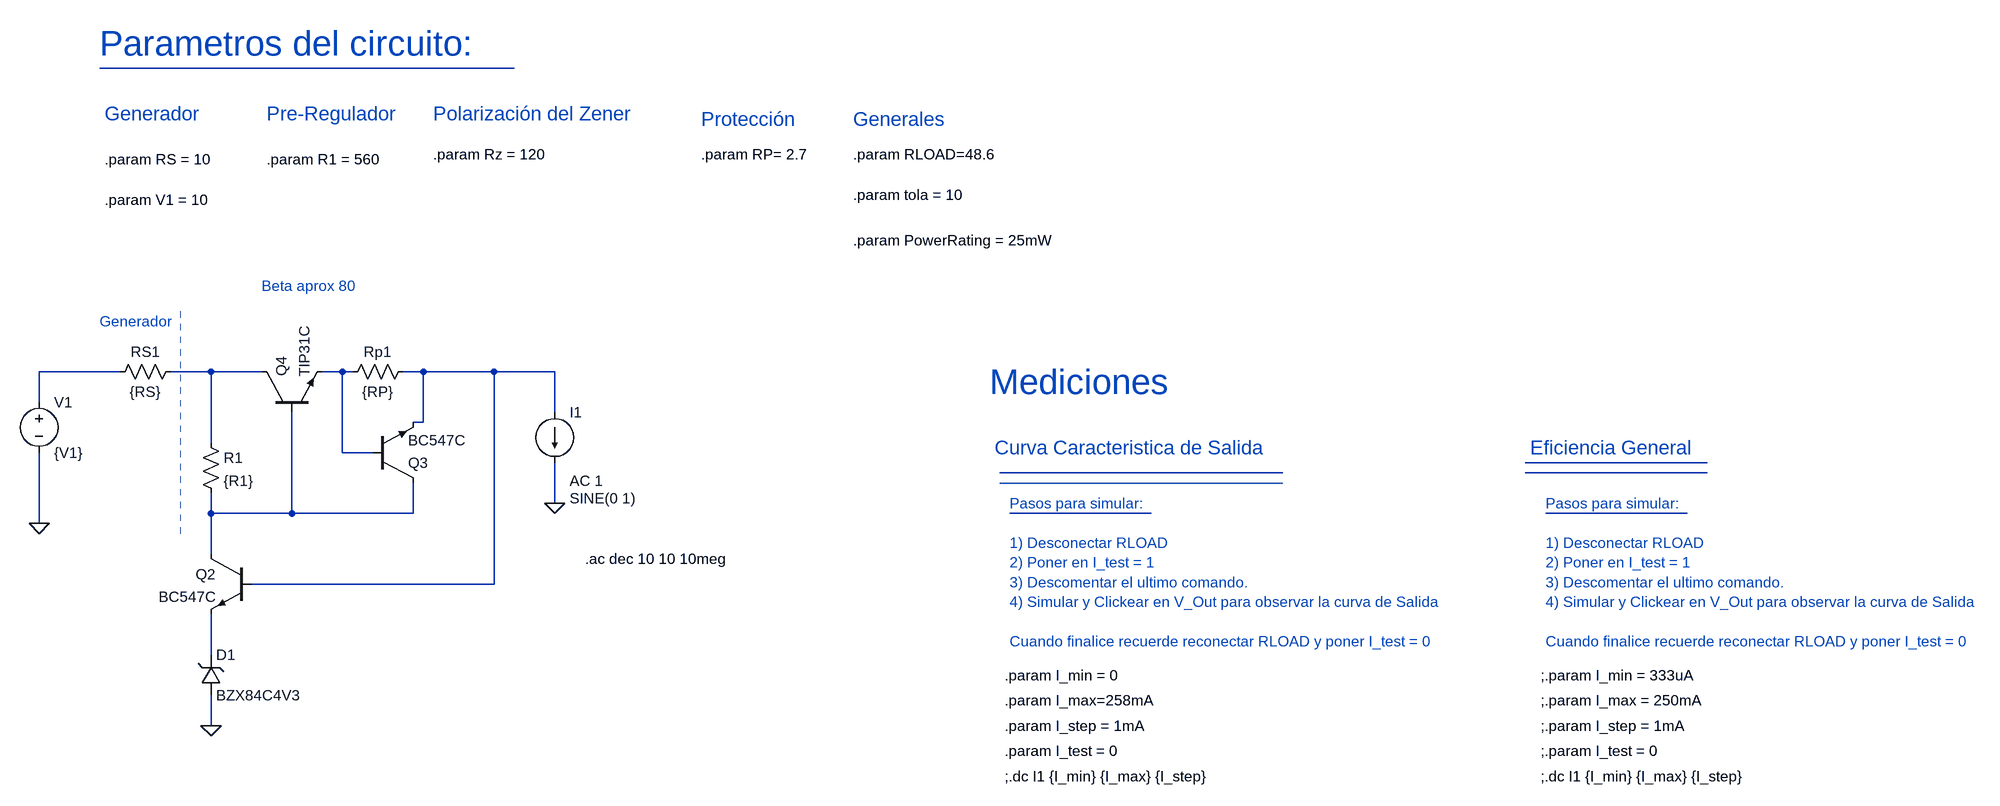
[diagram p0: schematic Draft1.asc]
Draft1.asc, the LTspice schematic file:
Version 4
SHEET 1 1764 680
WIRE -608 -480 -1264 -480
WIRE -1232 0 -1360 0
WIRE -1088 0 -1152 0
WIRE -1008 0 -1088 0
WIRE -880 0 -912 0
WIRE -864 0 -880 0
WIRE -752 0 -784 0
WIRE -640 0 -752 0
WIRE -544 0 -640 0
WIRE -1360 48 -1360 0
WIRE -544 64 -544 0
WIRE -752 80 -752 0
WIRE -752 80 -768 80
WIRE -1088 112 -1088 0
WIRE -880 128 -880 0
WIRE -832 128 -880 128
WIRE 1280 144 992 144
WIRE 608 160 160 160
WIRE 1280 160 992 160
WIRE -544 208 -544 144
WIRE -1088 224 -1088 192
WIRE -960 224 -960 64
WIRE -960 224 -1088 224
WIRE -768 224 -768 176
WIRE -768 224 -960 224
WIRE 400 224 176 224
WIRE 1248 224 1024 224
WIRE -1360 240 -1360 128
WIRE -1088 288 -1088 224
WIRE -640 336 -640 0
WIRE -640 336 -1024 336
WIRE -1088 448 -1088 384
WIRE -1088 560 -1088 512
FLAG -1360 240 0
FLAG -1088 560 0
FLAG -544 208 0
DATAFLAG -656 0 ""
DATAFLAG -1088 0 ""
DATAFLAG -1088 224 ""
SYMBOL res -1136 -16 R90
WINDOW 0 0 56 VBottom 2
WINDOW 3 32 56 VTop 2
SYMATTR InstName RS1
SYMATTR Value {RS}
SYMATTR SpiceLine tol={tola} pwr={PowerRating }
SYMBOL npn -1024 288 M0
SYMATTR InstName Q2
SYMATTR Value BC547C
SYMBOL zener -1104 512 M180
WINDOW 0 24 64 Left 2
WINDOW 3 24 0 Left 2
SYMATTR InstName D1
SYMATTR Value BZX84C4V3
SYMBOL res -768 -16 R90
WINDOW 0 0 56 VBottom 2
WINDOW 3 32 56 VTop 2
SYMATTR InstName Rp1
SYMATTR Value {RP}
SYMATTR SpiceLine tol={tola} pwr={PowerRating}
SYMBOL res -1104 96 R0
SYMATTR InstName R1
SYMATTR Value {R1}
SYMATTR SpiceLine tol={tola} pwr={PowerRating}
SYMBOL npn -832 176 M180
SYMATTR InstName Q3
SYMATTR Value BC547C
SYMBOL current -544 64 R0
WINDOW 3 24 136 Left 2
WINDOW 123 24 108 Left 2
WINDOW 39 0 0 Left 0
SYMATTR InstName I1
SYMATTR Value SINE(0 1)
SYMATTR Value2 AC 1
SYMBOL voltage -1360 32 R0
WINDOW 123 0 0 Left 0
WINDOW 39 0 0 Left 0
SYMATTR InstName V1
SYMATTR Value {V1}
SYMBOL npn -1008 64 R270
SYMATTR InstName Q4
SYMATTR Value TIP31C
TEXT -1264 -80 Left 2 ;Generador
TEXT -1008 -136 Left 2 ;Beta aprox 80
TEXT 144 16 Left 5 ;Mediciones
TEXT 152 120 Left 3 ;Curva Caracteristica de Salida
TEXT 168 480 Left 2 !.param I_min = 0
TEXT 168 520 Left 2 !.param I_max=258mA
TEXT 168 560 Left 2 !.param I_step = 1mA
TEXT 168 600 Left 2 !.param I_test = 0
TEXT 176 208 Left 2 ;Pasos para simular:\n \n1) Desconectar RLOAD\n2) Poner en I_test = 1\n3) Descomentar el ultimo comando.\n4) Simular y Clickear en V_Out para observar la curva de Salida\n \nCuando finalice recuerde reconectar RLOAD y poner I_test = 0
TEXT -1264 -520 Left 5 ;Parametros del circuito:
TEXT -1256 -336 Left 2 !.param RS = 10
TEXT -1256 -272 Left 2 !.param V1 = 10
TEXT -1000 -336 Left 2 !.param R1 = 560
TEXT -1256 -408 Left 3 ;Generador
TEXT -1000 -408 Left 3 ;Pre-Regulador
TEXT -736 -408 Left 3 ;Polarización del Zener
TEXT -736 -344 Left 2 !.param Rz = 120
TEXT -312 -344 Left 2 !.param RP= 2.7
TEXT -312 -400 Left 3 ;Protección
TEXT 1016 640 Left 2 !;.dc I1 {I_min} {I_max} {I_step}
TEXT 1000 120 Left 3 ;Eficiencia General
TEXT 1016 480 Left 2 !;.param I_min = 333uA
TEXT 1016 520 Left 2 !;.param I_max = 250mA
TEXT 1016 560 Left 2 !;.param I_step = 1mA
TEXT 1016 600 Left 2 !;.param I_test = 0
TEXT 1024 208 Left 2 ;Pasos para simular:\n \n1) Desconectar RLOAD\n2) Poner en I_test = 1\n3) Descomentar el ultimo comando.\n4) Simular y Clickear en V_Out para observar la curva de Salida\n \nCuando finalice recuerde reconectar RLOAD y poner I_test = 0
TEXT -72 -280 Left 2 !.param tola = 10
TEXT -72 -344 Left 2 !.param RLOAD=48.6
TEXT -72 -400 Left 3 ;Generales
TEXT -72 -208 Left 2 !.param PowerRating = 25mW
TEXT 168 640 Left 2 !;.dc I1 {I_min} {I_max} {I_step}
TEXT -496 296 Left 2 !.ac dec 10 10 10meg
LINE Normal -1136 256 -1136 -96 2
LINE Normal 608 176 160 176

The netlist it stands for:
* Draft1.asc
RS1 N003 N002 {RS} tol={tola} pwr={PowerRating }
Q2 N009 N005 N012 0 BC547C
D1 0 N012 BZX84C4V3
Rp1 N005 N004 {RP} tol={tola} pwr={PowerRating}
R1 N003 N009 {R1} tol={tola} pwr={PowerRating}
Q3 N009 N004 N005 0 BC547C
I1 N005 0 SINE(0 1) AC 1
V1 N002 0 {V1}
Q4 N003 N009 N004 0 TIP31C
.model D D
.lib standard.dio
.model NPN NPN
.model PNP PNP
.lib standard.bjt
* Generador
* Beta aprox 80
* Mediciones
* Curva Caracteristica de Salida
.param I_min = 0
.param I_max=258mA
.param I_step = 1mA
.param I_test = 0
* Pasos para simular:
* 1) Desconectar RLOAD
* 2) Poner en I_test = 1
* 3) Descomentar el ultimo comando.
* 4) Simular y Clickear en V_Out para observar la curva de Salida
* Cuando finalice recuerde reconectar RLOAD y poner I_test = 0
* Parametros del circuito:
.param RS = 10
.param V1 = 10
.param R1 = 560
* Generador
* Pre-Regulador
* Polarización del Zener
.param Rz = 120
.param RP= 2.7
* Protección
;.dc I1 {I_min} {I_max} {I_step}
* Eficiencia General
;.param I_min = 333uA
;.param I_max = 250mA
;.param I_step = 1mA
;.param I_test = 0
* Pasos para simular:
* 1) Desconectar RLOAD
* 2) Poner en I_test = 1
* 3) Descomentar el ultimo comando.
* 4) Simular y Clickear en V_Out para observar la curva de Salida
* Cuando finalice recuerde reconectar RLOAD y poner I_test = 0
.param tola = 10
.param RLOAD=48.6
* Generales
.param PowerRating = 25mW
;.dc I1 {I_min} {I_max} {I_step}
.ac dec 10 10 10meg
.backanno
.end